# Altium schematic sheet P03_Connectors.SchDoc
size A4; SheetNumber: 3; SheetTotal: 3
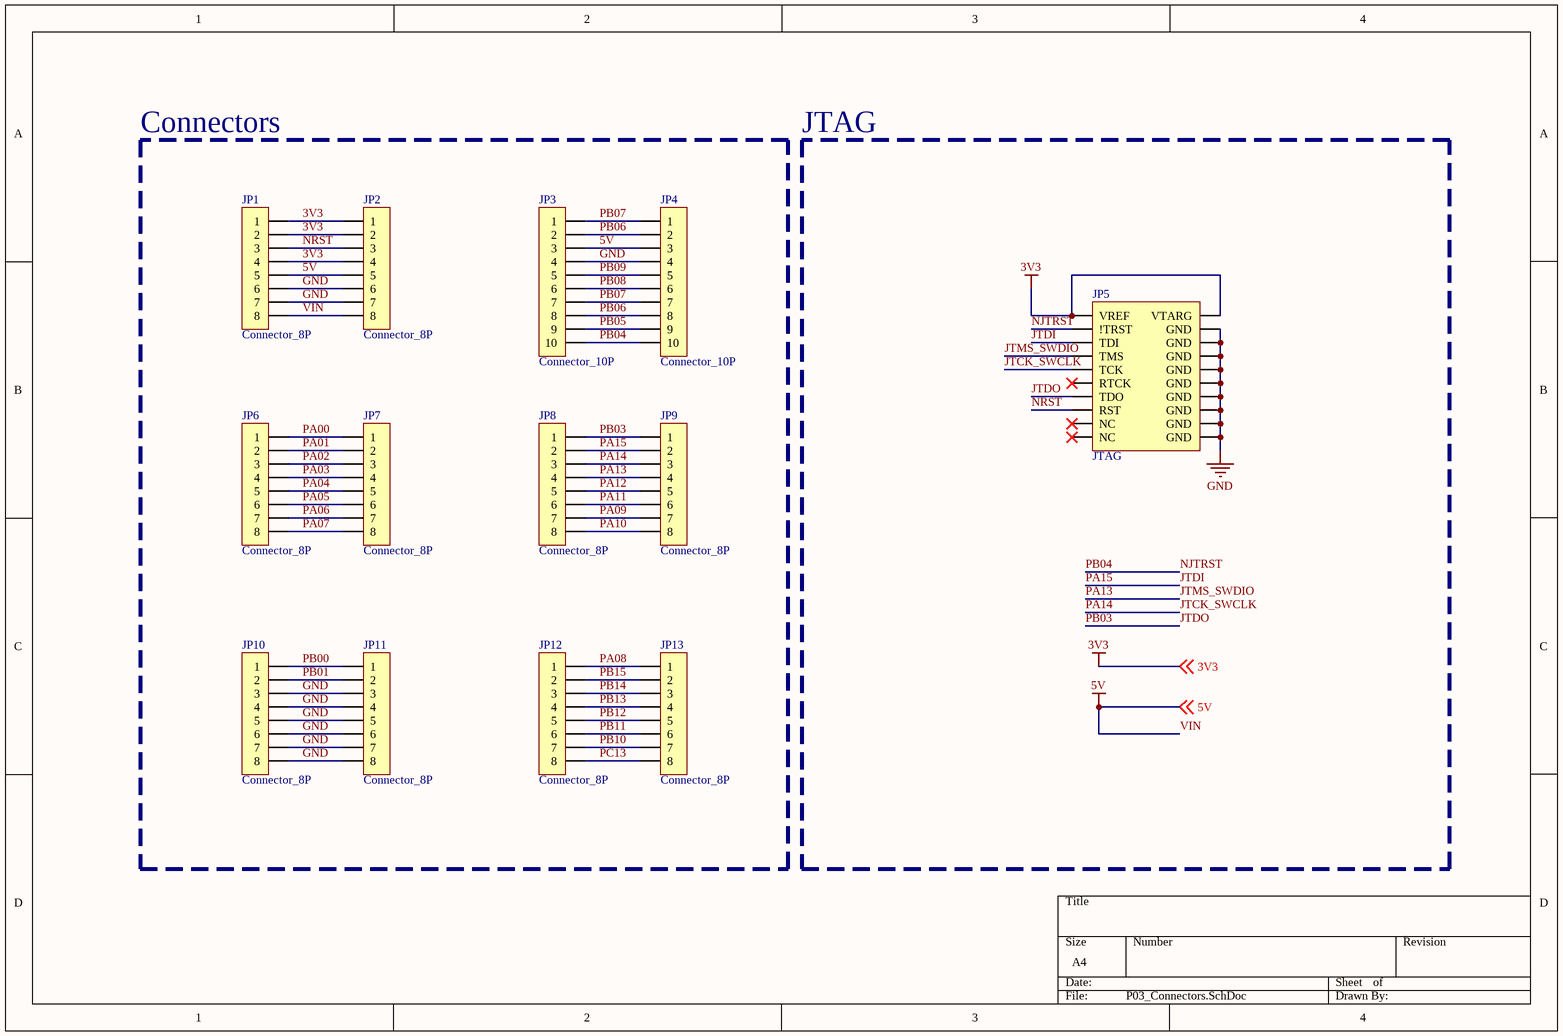
[diagram p0: P03_Connectors.SchDoc]

## Parts
JP1  Connector_8P  [排母_2.54mm_8P]
JP2  Connector_8P  [排针_2.54mm_8P]
JP3  Connector_10P  [排母_2.54mm_10P]
JP4  Connector_10P  [排针_2.54mm_10P]
JP5  JTAG  [JTAG]
JP6  Connector_8P  [排母_2.54mm_8P]
JP7  Connector_8P  [排针_2.54mm_8P]
JP8  Connector_8P  [排母_2.54mm_8P]
JP9  Connector_8P  [排针_2.54mm_8P]
JP10  Connector_8P  [排母_2.54mm_8P]
JP11  Connector_8P  [排针_2.54mm_8P]
JP12  Connector_8P  [排母_2.54mm_8P]
JP13  Connector_8P  [排针_2.54mm_8P]

## Blocks framed on the sheet
Connectors: JP1-JP4 JP6-JP13
JTAG: JP5

## Nets
3V3: JP1.1 JP1.2 JP1.4 JP2.1 JP2.2 JP2.4 JP5.1(VREF) JP5.2(VTARG) ; off-sheet 3V3
5V: JP1.5 JP1.8 JP2.5 JP2.8 JP3.3 JP4.3 ; off-sheet 5V  [also labelled VIN]
GND: JP1.6 JP1.7 JP2.6 JP2.7 JP3.4 JP4.4 JP5.4(GND) JP5.6(GND) JP5.8(GND) JP5.10(GND) JP5.12(GND) JP5.14(GND) JP5.16(GND) JP5.18(GND) JP5.20(GND) JP10.3 JP10.4 JP10.5 JP10.6 JP10.7 JP10.8 JP11.3 JP11.4 JP11.5 JP11.6 JP11.7 JP11.8
JTCK_SWCLK: JP5.9(TCK) JP8.3 JP9.3  [also labelled PA14]
JTDI: JP5.5(TDI) JP8.2 JP9.2  [also labelled PA15]
JTDO: JP5.13(TDO) JP8.1 JP9.1  [also labelled PB03]
JTMS_SWDIO: JP5.7(TMS) JP8.4 JP9.4  [also labelled PA13]
NJTRST: JP3.10 JP4.10 JP5.3(!TRST)  [also labelled PB04]
NRST: JP1.3 JP2.3 JP5.15(RST)
PA00: JP6.1 JP7.1
PA01: JP6.2 JP7.2
PA02: JP6.3 JP7.3
PA03: JP6.4 JP7.4
PA04: JP6.5 JP7.5
PA05: JP6.6 JP7.6
PA06: JP6.7 JP7.7
PA07: JP6.8 JP7.8
PA08: JP12.1 JP13.1
PA09: JP8.7 JP9.7
PA10: JP8.8 JP9.8
PA11: JP8.6 JP9.6
PA12: JP8.5 JP9.5
PB00: JP10.1 JP11.1
PB01: JP10.2 JP11.2
PB05: JP3.9 JP4.9
PB06: JP3.2 JP3.8 JP4.2 JP4.8
PB07: JP3.1 JP3.7 JP4.1 JP4.7
PB08: JP3.6 JP4.6
PB09: JP3.5 JP4.5
PB10: JP12.7 JP13.7
PB11: JP12.6 JP13.6
PB12: JP12.5 JP13.5
PB13: JP12.4 JP13.4
PB14: JP12.3 JP13.3
PB15: JP12.2 JP13.2
PC13: JP12.8 JP13.8

Not connected (* = marked no-connect by the designer): JP5 11(RTCK)* 17(NC)* 19(NC)*